# Altium schematic sheet CE842170047_SHEET4.SchDoc
size Tabloid; SheetNumber: 3; SheetTotal: 5; PageSetup: Record=PageOptions|CenterHorizontal=True|CenterVertical=True|PrintScale=0.70|XCorrection=1.00|YCorrection=1.00|PrintKind=1|BorderSize=5000000|LeftOffset=0|BottomOffset=0|Orientation=2|PaperLength=1000|PaperWidth=1000|Scale=100|PaperSource=7|PrintQuality=-4|MediaType=1|DitherType=10|PaperKind=8 1/2x11|PrintScaleMode=1; SPICEModelCacheMIYJXAQF: <root> / <DocumentId>MIYJXAQF</DocumentId> / </root>
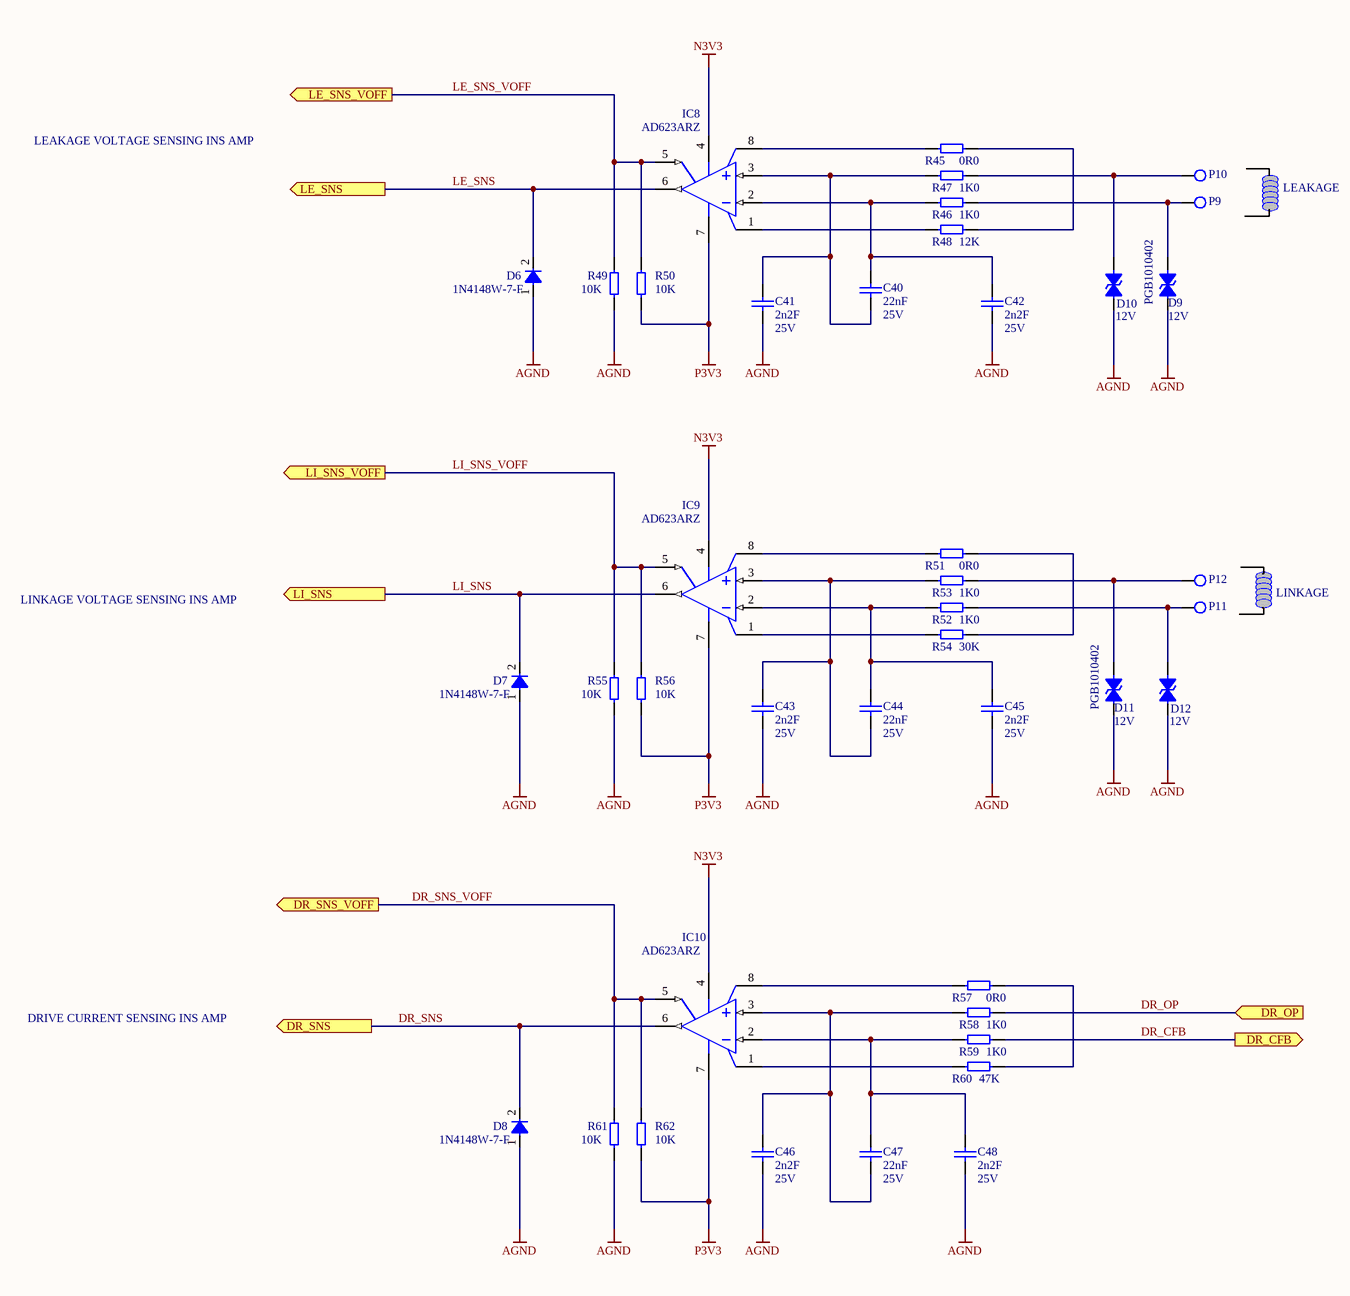
[diagram p0: CE842170047_SHEET4.SchDoc]

## Parts
C40  value 22nF  Voltage: 25V  [C0603]  (hidden comment: KK/96159/3434)
C41  value 2n2F  Voltage: 25V  [C0603]  (hidden comment: KK/96159/4334)
C42  value 2n2F  Voltage: 25V  [C0603]  (hidden comment: KK/96159/4334)
C43  value 2n2F  Voltage: 25V  [C0603]  (hidden comment: KK/96159/4334)
C44  value 22nF  Voltage: 25V  [C0603]  (hidden comment: KK/96159/3434)
C45  value 2n2F  Voltage: 25V  [C0603]  (hidden comment: KK/96159/4334)
C46  value 2n2F  Voltage: 25V  [C0603]  (hidden comment: KK/96159/4334)
C47  value 22nF  Voltage: 25V  [C0603]  (hidden comment: KK/96159/3434)
C48  value 2n2F  Voltage: 25V  [C0603]  (hidden comment: KK/96159/4334)
D6  MF_PartNumber: 1N4148W-7-F  [SOD-123]  (hidden comment: KK/95048/0189)
D7  MF_PartNumber: 1N4148W-7-F  [SOD-123]  (hidden comment: KK/95048/0189)
D8  MF_PartNumber: 1N4148W-7-F  [SOD-123]  (hidden comment: KK/95048/0189)
D9  MF_PartNumber: PGB1010402  Voltage: 12V  [ESD0402]  (hidden comment: KK/95070/0036)
D10  Voltage: 12V  [ESD0402]  (hidden comment: KK/95070/0036)
D11  MF_PartNumber: PGB1010402  Voltage: 12V  [ESD0402]  (hidden comment: KK/95070/0036)
D12  Voltage: 12V  [ESD0402]  (hidden comment: KK/95070/0036)
IC8  MF_PartNumber: AD623ARZ  [SOIC-8]  (hidden comment: KK/95312/0245)
IC9  MF_PartNumber: AD623ARZ  [SOIC-8]  (hidden comment: KK/95312/0245)
IC10  MF_PartNumber: AD623ARZ  [SOIC-8]  (hidden comment: KK/95312/0245)
P9  TESTPAD1  [P0.8xH0.5]  (value not drawn)
P10  TESTPAD1  [P0.8xH0.5]  (value not drawn)
P11  TESTPAD1  [P0.8xH0.5]  (value not drawn)
P12  TESTPAD1  [P0.8xH0.5]  (value not drawn)
R45  value 0R0  [R0603]  (hidden comment: KK/96059/0000)
R46  value 1K0  [R0603]  (hidden comment: KK/96059/0501)
R47  value 1K0  [R0603]  (hidden comment: KK/96059/0501)
R48  value 12K  [R0603]  (hidden comment: KK/96059/0609)
R49  value 10K  [R0603]  (hidden comment: KK/96059/0601)
R50  value 10K  [R0603]  (hidden comment: KK/96059/0601)
R51  value 0R0  [R0603]  (hidden comment: KK/96059/0000)
R52  value 1K0  [R0603]  (hidden comment: KK/96059/0501)
R53  value 1K0  [R0603]  (hidden comment: KK/96059/0501)
R54  value 30K  [R0603]  (hidden comment: KK/96059/0647)
R55  value 10K  [R0603]  (hidden comment: KK/96059/0601)
R56  value 10K  [R0603]  (hidden comment: KK/96059/0601)
R57  value 0R0  [R0603]  (hidden comment: KK/96059/0000)
R58  value 1K0  [R0603]  (hidden comment: KK/96059/0501)
R59  value 1K0  [R0603]  (hidden comment: KK/96059/0501)
R60  value 47K  [R0603]  (hidden comment: KK/96059/4666)
R61  value 10K  [R0603]  (hidden comment: KK/96059/0601)
R62  value 10K  [R0603]  (hidden comment: KK/96059/0601)

## Ports
DR_CFB (out), DR_OP (in), DR_SNS (out), DR_SNS_VOFF (out), LE_SNS (out), LE_SNS_VOFF (out), LI_SNS (out), LI_SNS_VOFF (out)

## Nets
AGND: C41.2 C42.2 C43.2 C45.2 C46.2 C48.2 D6.1(A) D7.1(A) D8.1(A) D9.1 D10.1 D11.1 D12.1 R49.1 R55.1 R61.1
N3V3: IC8.4(-VS) IC9.4(-VS) IC10.4(-VS)
P3V3: IC8.7(+VS) IC9.7(+VS) IC10.7(+VS) R50.1 R56.1 R62.1
DR_CFB: R59.1 ; port DR_CFB
DR_OP: R58.1 ; port DR_OP
DR_SNS: D8.2(K) IC10.6(OUTPUT) ; port DR_SNS
DR_SNS_VOFF: IC10.5(REF) R61.2 R62.2 ; port DR_SNS_VOFF
LE_SNS: D6.2(K) IC8.6(OUTPUT) ; port LE_SNS
LE_SNS_VOFF: IC8.5(REF) R49.2 R50.2 ; port LE_SNS_VOFF
LI_SNS: D7.2(K) IC9.6(OUTPUT) ; port LI_SNS
LI_SNS_VOFF: IC9.5(REF) R55.2 R56.2 ; port LI_SNS_VOFF
NetC40_1: C40.1 C42.1 IC8.2(-IN) R46.2
NetC40_2: C40.2 C41.1 IC8.3(+IN) R47.2
NetC43_1: C43.1 C44.2 IC9.3(+IN) R53.2
NetC44_1: C44.1 C45.1 IC9.2(-IN) R52.2
NetC46_1: C46.1 C47.2 IC10.3(+IN) R58.2
NetC47_1: C47.1 C48.1 IC10.2(-IN) R59.2
NetD9_2: D9.2 P9.1 R46.1
NetD10_2: D10.2 P10.1 R47.1
NetD11_2: D11.2 P12.1 R53.1
NetD12_2: D12.2 P11.1 R52.1
NetIC8_1: IC8.1(-RG) R48.1
NetIC8_8: IC8.8(+RG) R45.1
NetIC9_1: IC9.1(-RG) R54.1
NetIC9_8: IC9.8(+RG) R51.1
NetIC10_1: IC10.1(-RG) R60.1
NetIC10_8: IC10.8(+RG) R57.1
NetR45_2: R45.2 R48.2
NetR51_2: R51.2 R54.2
NetR57_2: R57.2 R60.2

## Notes on the sheet
- LEAKAGE VOLTAGE SENSING INS AMP
- LEAKAGE
- LINKAGE VOLTAGE SENSING INS AMP
- LINKAGE
- DRIVE CURRENT SENSING INS AMP
- BH CONFIDENTIAL
- NOTE
- Title:
- Sheet Title:
- Designed:
- Checked:
- Date:
- DRAWN IN ACCORDANCE WITH TECHNOLOGY WORK INSTRUCTIONS W064
- REV
- DATE
- ECR/ECN
- INT'L
- Number:
- Approved:
- FOR LIMITED NEED TO KNOW USE ONLY. NO PARTS OF THIS DOCUMENT MAY BE PRODUCED OR DISCLOSED WITHOUT PRIOR PERMISSION OF BH
- File:
- Sheet:
- of

## Library data of the parts
C40 C44 C47 = KK/96159/3434: CAPACITOR CERAMIC 0603 25V 10% X7R 22nF; ID: 572; PII_PartNumber: KK/96159/3434; Pins: 2; Tolerance: 10%
C41-C43 C45 C46 C48 = KK/96159/4334: CAPACITOR_2.2nF_10%_25V_603; ID: 182; Tolerance: 10%; PII_PartNumber: KK/96159/4334; Pins: 2
D6-D8 = KK/95048/0189: DIODE SWITCHING POWER; Manufacturer: DIODES; ID: 362; Power: 2A; Voltage: 100V; PII_PartNumber: KK/95048/0189; Pins: 2; Temperature: -65 to +150C
D9-D12 = KK/95070/0036: SUPPRESSOR ESD,SMD,0402,12VDC,LIF,PGB1010402; Manufacturer: LITTELFUSE; ID: 262; PII_PartNumber: KK/95070/0036; Pins: 2
  D10 D12: MF_PartNumber: PGB1010402
IC8-IC10 = KK/95312/0245: SINGLE RAIL to RAIL INSTRUMENTATION AMPLIFIER; Manufacturer: Analog Devices; EDA / CAD Models: DownloadfromAcceleratedDesigns; PCN Design/Specification: AD623PolymideThickness02/Oct/2013AD623PolymideThickness15/Oct/2013; Output Type: Rail-to-Rail; -3db Bandwidth: 800kHz; Voltage - Supply, Single/Dual (±): 2.7V~12V,±2.5V~6V; Current - Input Bias: 17nA; Voltage - Input Offset: 25µV; Slew Rate: 0.3V/µs; Current - Supply: 375µA; Mfg Application Notes: Electrocardiogram(ECG)Solutions; Number of Circuits: 1; Product Training Modules: InstrumentationAmplifiersPerformanceCommonPhotodiodeOp-AmpCircuitProblemsandSolutionsIndirectCurrentFeedbackInstrumentationAmplifierApplicationsGuide; ID: 107; Value: 800KHz; Voltage: 2.7V to 12V; Manufacturer URL: http://www.analog.com/; Packaging: Tube; Mounting Type: SurfaceMount; Gain Bandwidth Product: -; Datasheet URL: https://datasheet.ciiva.com/20167/82-1224-20167284.pdf; Current - Output / Channel: -; Standard Package: 98; Supplier Device Package: 8-SOIC; Amplifier Type: Instrumentation; Datasheet Version: Rev. D, 07/2008; Family: Linear-Amplifiers-Instrumentation,OPAmps,BufferAmps; Online Catalog: Instrumentation; Operating Temperature: -40degC~85degC; Category: IntegratedCircuits(ICs); Package / Case: 8-SOIC(0.154",3.90mmWidth); Series: -; Manufacturer Part Number: AD623ARZ; PII_PartNumber: KK/95312/0245; Pins: 8; Temperature: -40 to + 85C
P9-P12 = TESTPAD1: P0.8 X H0.5 X 0.9SM; Manufacturer: PCB MANUFACTURER; ID: 26; MF_PartNumber: P0.8 X H0.5 X 0.9SM; PII_PartNumber: TESTPAD1; Pins: 1
R45 R51 R57 = KK/96059/0000: ZERO OHM LINK; ID: 7; Power: 63mW; PII_PartNumber: KK/96059/0000; Pins: 2
R46 R47 R52 R53 R58 R59 = KK/96059/0501: RESISTOR_1K0_1%_0603J_63mW; ID: 1072; Tolerance: 1%; Power: 0.1W; PII_PartNumber: KK/96059/0501; Pins: 2
R48 = KK/96059/0609: RESISTOR 0603 0.063W 1% 12K; ID: 1405; PII_PartNumber: KK/96059/0609; Pins: 2; Tolerance: 1%; Power: 0.063W
R49 R50 R55 R56 R61 R62 = KK/96059/0601: RESISTOR_10K_1%_0603J_63mW; ID: 1090; Tolerance: 1%; Power: 63mW; PII_PartNumber: KK/96059/0601; Pins: 2
R54 = KK/96059/0647: RESISTOR_30K_1%_0603_63mW; ID: 1098; Tolerance: 1%; Power: 63mW; PII_PartNumber: KK/96059/0647; Pins: 2
R60 = KK/96059/4666: RESISTOR,SMD,0603,0.1W,1%,47K; ID: 1407; PII_PartNumber: KK/96059/4666; Pins: 2; Tolerance: 1%; Power: 0.1W